# EasyEDA Pro project ZeptoWatch.eprj, board PCB2
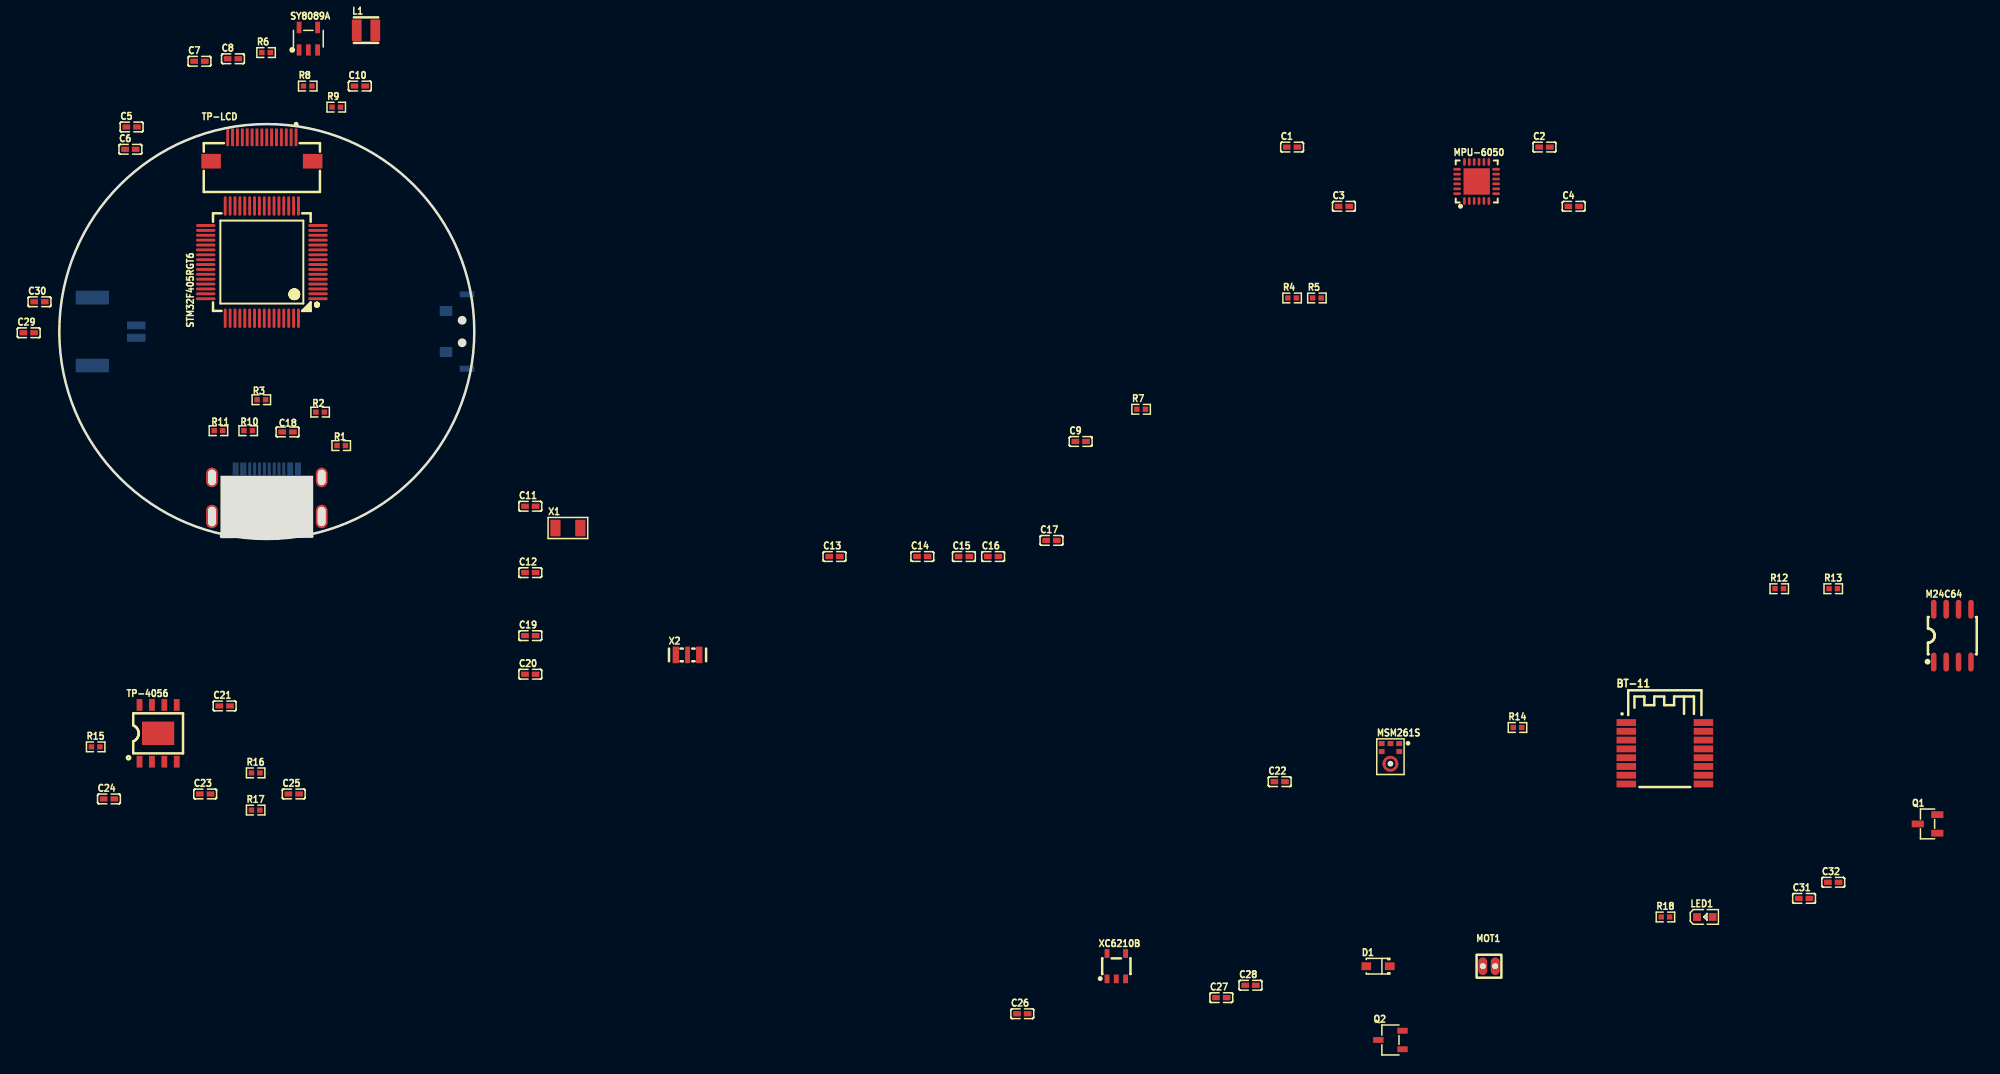
[diagram p8: board, top side]
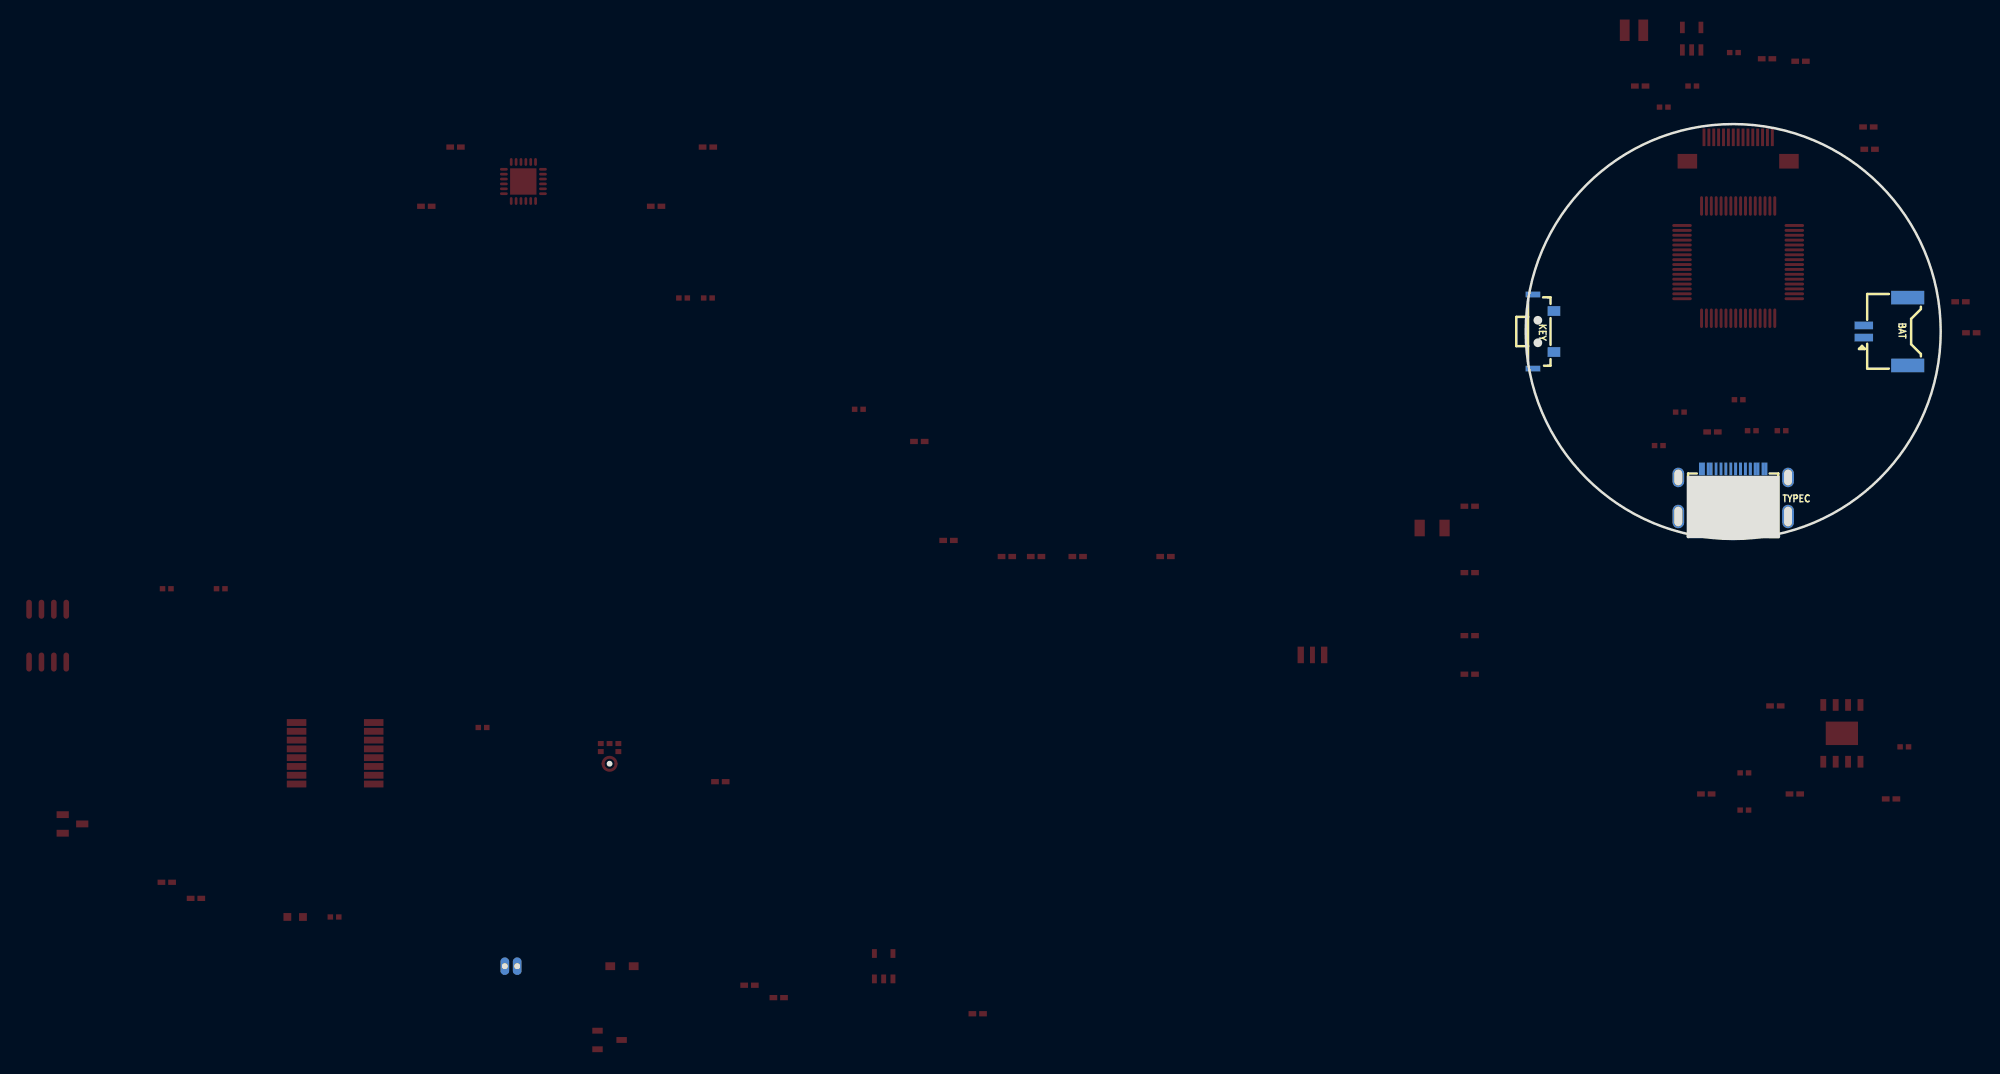
[diagram p9: board, bottom side, seen from below]

Outline 136.62 x 65.82 mm; copper layers: Top Layer, Bottom Layer. Coordinates in mm from the lower left corner of the outline.
Outline path: circle c21.25,44.57 r21.25
Stack: Top Layer 0.035mm / Dielectric1 1.51mm FR4 er 4.5 / Bottom Layer 0.035mm

## Design rules (mm)
spacing safeClearance (default): track to track 0.152, other pairs 0.152 to 0.3
track width trackWidth (default): min 0.127, default 0.254, max 2.54
differential pair differentialPair (default): width min 0.127, default 0.254, max 2.54; gap min 0.152, default 0.152
via viaSize (default): diameter min 0.5, default 0.61, max 10; hole min 0.3, default 0.305, max 6

## Placement (name value [footprint] x y rotation side)
BAT  1.25K-CB-2PWB  [CONN-SMD_2P-P1.25_L5.5-W7.7-2PWB]  5.63 44.57 90 bottom
BT-11  -  [BT-11]  160.68 7.82 0 top
C1  100nF  [C0402]  126.25 63.47 0 top
C2  100nF  [C0402]  152.1 63.47 0 top
C3  2.2nF  [C0402]  131.56 57.4 0 top
C4  100nF  [C0402]  155.09 57.4 0 top
C5  100nF  [C0402]  7.41 65.53 0 top
C6  100nF  [C0402]  7.28 63.24 0 top
C7  10uF  [C0402]  14.36 72.26 0 top
C8  100nF  [C0402]  17.78 72.51 0 top
C9  100nF  [C0402]  104.6 33.31 0 top
C10  -  [C0402]  30.78 69.72 0 top
C11  10pF  [C0402]  48.24 26.67 0 top
C12  10pF  [C0402]  48.24 19.87 0 top
C13  100nF  [C0402]  79.39 21.52 0 top
C14  100nF  [C0402]  88.38 21.52 0 top
C15  100nF  [C0402]  92.64 21.52 0 top
C16  100nF  [C0402]  95.63 21.52 0 top
C17  100nF  [C0402]  101.61 23.17 0 top
C18  10uF  [C0402]  23.37 34.28 0 top
C19  20pF  [C0402]  48.24 13.42 0 top
C20  20pF  [C0402]  48.24 9.47 0 top
C21  100nF  [C0402]  16.93 6.22 0 top
C22  100nF  [C0402]  124.98 -1.54 0 top
C23  100nF  [C0402]  14.94 -2.8 0 top
C24  100nF  [C0402]  5.08 -3.31 0 top
C25  100nF  [C0402]  24.01 -2.8 0 top
C26  100nF  [C0402]  98.62 -25.31 0 top
C27  100nF  [C0402]  119 -23.67 0 top
C28  10uF  [C0402]  121.99 -22.4 0 top
C29  10uF  [C0402]  -3.13 44.44 0 top
C30  100nF  [C0402]  -2.03 47.62 0 top
C31  100nF  [C0402]  178.68 -13.5 0 top
C32  10uF  [C0402]  181.67 -11.85 0 top
D1  B5819WS  [SOD-323_L1.8-W1.3-LS2.5-FD]  135.05 -20.44 0 top
KEY  TS-KG012EV  [SW-SMD_TS-KG012EV]  40.68 44.57 270 bottom
L1  2.2uH  [IND-SMD_L2.5-W2.0_SWPA252012S]  31.41 75.43 0 top
LED1  D-060306B1  [LED0603-RD]  168.52 -15.4 0 top
M24C64  M24C64-RMN6TP  [SOIC-8_L5.0-W4.0-P1.27-LS6.0-BL]  193.87 13.42 0 top
MOT1  LCM1027A2445F  [VIBRATING-MOTOR-SMD_WELDING]  146.42 -20.44 0 top
MPU-6050  MPU-6050  [QFN-24_L4.0-W4.0-P0.50-BL-EP2.7]  145.15 59.94 0 top
MSM261S  MSM261S3526Z0CM  [MIC-SMD_6P-L3.5-W2.7-P0.90-TR]  136.32 1 0 top
Q1  AO3401  [SOT-23-3_L2.9-W1.3-P1.90-LS2.4-BR]  191.33 -5.87 0 top
Q2  AO3400A  [SOT-23-3_L2.9-W1.6-P1.90-LS2.8-BR]  136.32 -28 0 top
R1  22Ω  [R0402]  28.87 32.89 0 top
R2  22Ω  [R0402]  26.71 36.32 0 top
R3  1.5kΩ  [R0402]  20.69 37.59 0 top
R4  2.2kΩ  [R0402]  126.25 48.01 0 top
R5  2.2kΩ  [R0402]  128.79 48.01 0 top
R6  100kΩ  [R0402]  21.17 73.15 0 top
R7  47kΩ  [R0402]  110.79 36.61 0 top
R8  7.5kΩ  [R0402]  25.44 69.72 0 top
R9  0402 ±5% 10Ω  [R0402]  28.36 67.56 0 top
R10  5.1kΩ  [R0402]  19.34 34.41 0 top
R11  5.1kΩ  [R0402]  16.3 34.41 180 top
R12  10kΩ  [R0402]  176.14 18.22 0 top
R13  10kΩ  [R0402]  181.67 18.22 0 top
R14  100kΩ  [R0402]  149.34 4.01 0 top
R15  2kΩ  [R0402]  3.72 2.03 0 top
R16  20kΩ  [R0402]  20.11 -0.64 0 top
R17  20kΩ  [R0402]  20.11 -4.45 0 top
R18  1kΩ  [R0402]  164.49 -15.4 0 top
STM32F405RGT6  STM32F405RGT6  [LQFP-64_L10.0-W10.0-P0.50-LS12.0-BL]  20.74 51.68 90 top
SY8089A  SY8089A1AAC  [SOT-23-5_L3.0-W1.7-P0.95-LS2.8-BL]  25.51 74.57 0 top
TP-4056  TP4056  [ESOP-8_L4.9-W3.9-P1.27-LS6.0-BL-EP]  10.12 3.41 0 top
TP-LCD  KH-FG0.5-H2.0-15PIN  [FPC-SMD_15P-P0.50_KINGHELM_KH-FG0.5-H2.0-15PIN]  20.74 63.24 0 top
TYPEC  TYPE-C-16M-005  [USB-C-SMD_TYPE-C-16M-005]  21.25 28.06 180 bottom
X1  32.768kHz  [OSC-SMD_L3.2-W1.5]  52.09 24.44 0 top
X2  8MHz  [OSC-SMD_3P-L3.2-W1.3-P1.2-L]  64.34 11.44 0 top
XC6210B  XC6210B332MR  [SOT-25_L3.0-W1.6-P0.95-LS2.8-BL]  108.25 -20.44 0 top

## Footprints (pads in the part's own frame, mm; a bottom-side part is the same pattern mirrored in y, then rotated)
BT-11
  rect 2x0.7 smd: 1(-0.2,-3.3) 2(-0.2,-4.2) 3(-0.2,-5.1) 4(-0.2,-6) 5(-0.2,-6.9) 6(-0.2,-7.8) 7(-0.2,-8.7) 8(-0.2,-9.6) 9(7.7,-9.6) 10(7.7,-8.7) 11(7.7,-7.8) 12(7.7,-6.9) 13(7.7,-6) 14(7.7,-5.1) 15(7.7,-4.2) 16(7.7,-3.3)
C0402
  rect 0.79x0.54 smd: 1(-0.545,0) 2(0.545,0)
CONN-SMD_2P-P1.25_L5.5-W7.7-2PWB
  rect 0.8x1.9 smd: 1(-0.625,2.25) 2(0.625,2.25)
  rect 1.4x3.4 smd: 3(3.475,-2.25) 4(-3.475,-2.25)
ESOP-8_L4.9-W3.9-P1.27-LS6.0-BL-EP
  rect 0.6x1.2 smd: 1(-1.905,-2.909) 2(-0.635,-2.909) 3(0.635,-2.909) 4(1.905,-2.909) 5(1.905,2.909) 6(0.635,2.909) 7(-0.635,2.909) 8(-1.905,2.909)
  rect 3.3x2.4 smd: 9(0,0)
FPC-SMD_15P-P0.50_KINGHELM_KH-FG0.5-H2.0-15PIN
  rect 0.3x1.8 smd: 1(3.5,1.225) 2(3,1.225) 3(2.5,1.225) 4(2,1.225) 5(1.5,1.225) 6(1,1.225) 7(0.5,1.225) 8(0,1.225) 9(-0.5,1.225) 10(-1,1.225) 11(-1.5,1.225) 12(-2,1.225) 13(-2.499,1.225) 14(-3,1.225) 15(-3.499,1.225)
  rect 2x1.5 smd: 16(-5.2,-1.225) 17(5.2,-1.225)
IND-SMD_L2.5-W2.0_SWPA252012S
  rect 1.001x2.2 smd: 1(-0.95,0) 2(0.95,0)
LED0603-RD
  rect 0.8x0.8 smd: 1(-0.799,-0.004) 2(0.799,0.004)
LQFP-64_L10.0-W10.0-P0.50-LS12.0-BL
  oval 0.3x2 smd: 1(-3.75,-5.75) 2(-3.25,-5.75) 3(-2.75,-5.75) 4(-2.25,-5.75) 5(-1.75,-5.75) 6(-1.25,-5.75) 7(-0.75,-5.75) 8(-0.25,-5.75) 9(0.25,-5.75) 10(0.75,-5.75) 11(1.25,-5.75) 12(1.75,-5.75) 13(2.25,-5.75) 14(2.75,-5.75) 15(3.25,-5.75) 16(3.75,-5.75) 33(3.75,5.75) 34(3.25,5.75) 35(2.75,5.75) 36(2.25,5.75) 37(1.75,5.75) 38(1.25,5.75) 39(0.75,5.75) 40(0.25,5.75) 41(-0.25,5.75) 42(-0.75,5.75) 43(-1.25,5.75) 44(-1.75,5.75) 45(-2.25,5.75) 46(-2.75,5.75) 47(-3.25,5.75) 48(-3.75,5.75)
  oval 2x0.3 smd: 17(5.75,-3.75) 18(5.75,-3.25) 19(5.75,-2.75) 20(5.75,-2.25) 21(5.75,-1.75) 22(5.75,-1.25) 23(5.75,-0.75) 24(5.75,-0.25) 25(5.75,0.25) 26(5.75,0.75) 27(5.75,1.25) 28(5.75,1.75) 29(5.75,2.25) 30(5.75,2.75) 31(5.75,3.25) 32(5.75,3.75) 49(-5.75,3.75) 50(-5.75,3.25) 51(-5.75,2.75) 52(-5.75,2.25) 53(-5.75,1.75) 54(-5.75,1.25) 55(-5.75,0.75) 56(-5.75,0.25) 57(-5.75,-0.25) 58(-5.75,-0.75) 59(-5.75,-1.25) 60(-5.75,-1.75) 61(-5.75,-2.25) 62(-5.75,-2.75) 63(-5.75,-3.25) 64(-5.75,-3.75)
MIC-SMD_6P-L3.5-W2.7-P0.90-TR
  rect 0.6x0.52 smd: 1(0.9,1.367) 2(0.9,0.545) 4(-0.9,0.545) 5(-0.9,1.367) 6(0,1.367)
  custom 0x0 smd: 3(0,-0.042) 3(0,-1.367)
OSC-SMD_3P-L3.2-W1.3-P1.2-L
  rect 0.65x1.7 smd: 1(-1.199,0) 3(1.199,0)
  rect 0.5x1.7 smd: 2(0,0)
OSC-SMD_L3.2-W1.5
  rect 1.049x1.7 smd: 1(-1.275,0) 2(1.275,0)
QFN-24_L4.0-W4.0-P0.50-BL-EP2.7
  oval 0.28x0.8 smd: 1(-1.25,-2) 2(-0.75,-2) 3(-0.25,-2) 4(0.25,-2) 5(0.75,-2) 6(1.25,-2) 13(1.25,2) 14(0.75,2) 15(0.25,2) 16(-0.25,2) 17(-0.75,2) 18(-1.242,2)
  oval 0.8x0.28 smd: 7(2,-1.25) 8(2,-0.75) 9(2,-0.25) 10(2,0.25) 11(2,0.75) 12(2,1.25) 19(-2,1.25) 20(-2,0.75) 21(-2,0.25) 22(-2,-0.25) 23(-2,-0.75) 24(-2,-1.25)
  rect 2.7x2.7 smd: 25(0.013,0)
R0402
  rect 0.566x0.54 smd: 1(-0.433,0) 2(0.433,0)
SOD-323_L1.8-W1.3-LS2.5-FD
  rect 1x0.8 smd: 1(-1.2,0) 2(1.2,0)
SOIC-8_L5.0-W4.0-P1.27-LS6.0-BL
  oval 0.569x1.95 smd: 1(-1.905,-2.705) 2(-0.635,-2.705) 3(0.635,-2.705) 4(1.905,-2.705) 5(1.905,2.705) 6(0.635,2.705) 7(-0.635,2.705) 8(-1.905,2.705)
SOT-23-3_L2.9-W1.3-P1.90-LS2.4-BR
  rect 1.25x0.7 smd: 1(1,-0.95) 2(1,0.95) 3(-1,0)
SOT-23-3_L2.9-W1.6-P1.90-LS2.8-BR
  rect 1.07x0.6 smd: 1(1.235,-0.95) 2(1.235,0.95) 3(-1.235,0)
SOT-23-5_L3.0-W1.7-P0.95-LS2.8-BL
  rect 0.49x1.157 smd: 1(-0.95,-1.153) 2(0,-1.153) 3(0.95,-1.153)
  rect 0.49x1.175 smd: 4(0.95,1.153) 5(-0.95,1.153)
SOT-25_L3.0-W1.6-P0.95-LS2.8-BL
  rect 0.5x0.899 smd: 1(-0.95,-1.3) 2(0,-1.3) 3(0.95,-1.3) 4(0.95,1.3) 5(-0.95,1.3)
SW-SMD_TS-KG012EV
  rect 1.001x1.3 smd: 1(2.1,1.075) 2(-2.1,1.075)
  rect 0.6x1.501 smd: 3(-3.8,-1.075) 4(3.8,-1.075)
USB-C-SMD_TYPE-C-16M-005
  oval 1.199x1.999 hole 0.8x1.6: 17(5.621,1.562) 20(-5.621,1.562)
  oval 1.199x2.401 hole 0.8x1.999: 18(5.621,-2.438) 19(-5.621,-2.438)
  rect 0.299x1.3 smd: A1(-3.35,2.438) A4(-2.55,2.438) A5(-1.25,2.438) A6(-0.249,2.438) A7(0.249,2.438) A8(1.25,2.438) A9(2.55,2.438) A12(3.35,2.438) B1(3.05,2.438) B4(2.251,2.438) B5(1.75,2.438) B6(0.75,2.438) B7(-0.75,2.438) B8(-1.75,2.438) B9(-2.251,2.438) B12(-3.05,2.438)
VIBRATING-MOTOR-SMD_WELDING
  oval 0.9x1.8 hole 0.61: 1(-0.635,0) 2(0.635,0)

## Nets
As in the schematic, except:
GND: BAT.2 BAT.3 BAT.4 BT-11.1 BT-11.15 C1.1 C2.2 C3.2 C4.1 C5.2 C6.2 C7.1 C8.2 C9.1 C10.1 C11.1 C12.1 C13.2 C14.2 C15.2 C16.2 C17.1 C18.1 C19.1 C20.1 C21.1 C22.2 C23.2 C24.2 C25.2 C26.2 C27.2 C28.1 C29.1 C30.2 C31.2 C32.1 KEY.3 KEY.4 LED1.1 M24C64.1 M24C64.2 M24C64.3 M24C64.4 M24C64.7 MPU-6050.1 MPU-6050.9 MPU-6050.11 MPU-6050.18 MPU-6050.25 MSM261S.3 MSM261S.4 Q2.2 R9.2 R10.1 R11.2 R15.1 R17.2 STM32F405RGT6.12 STM32F405RGT6.18 STM32F405RGT6.63 SY8089A.2 TP-4056.1 TP-4056.3 TP-4056.9 TP-LCD.1 TP-LCD.6 TP-LCD.11 TP-LCD.16 TP-LCD.17 TYPEC.17 TYPEC.18 TYPEC.19 TYPEC.20 TYPEC.A1 TYPEC.A12 TYPEC.B1 TYPEC.B12 X2.2 XC6210B.2
LCD_LEDK: C10.2 R8.2 R9.1 TP-LCD.2

Pads without a net: BT-11 4 5 6 7 10 11 12 13 16; MPU-6050 2 3 4 5 6 7 12 14 15 16 17 19 21 22; STM32F405RGT6 2 11 26 27 28 31 33 34 35 36 37 38 39 40 43 47 50 52 54 57 59 60; TP-4056 6; TP-LCD 13; TYPEC A8 B8; XC6210B 4
